# Altium schematic sheet Digitalizador_RPi (Copia en conflicto de Ivan Palacios 2020-06-25).SchDoc
size A1
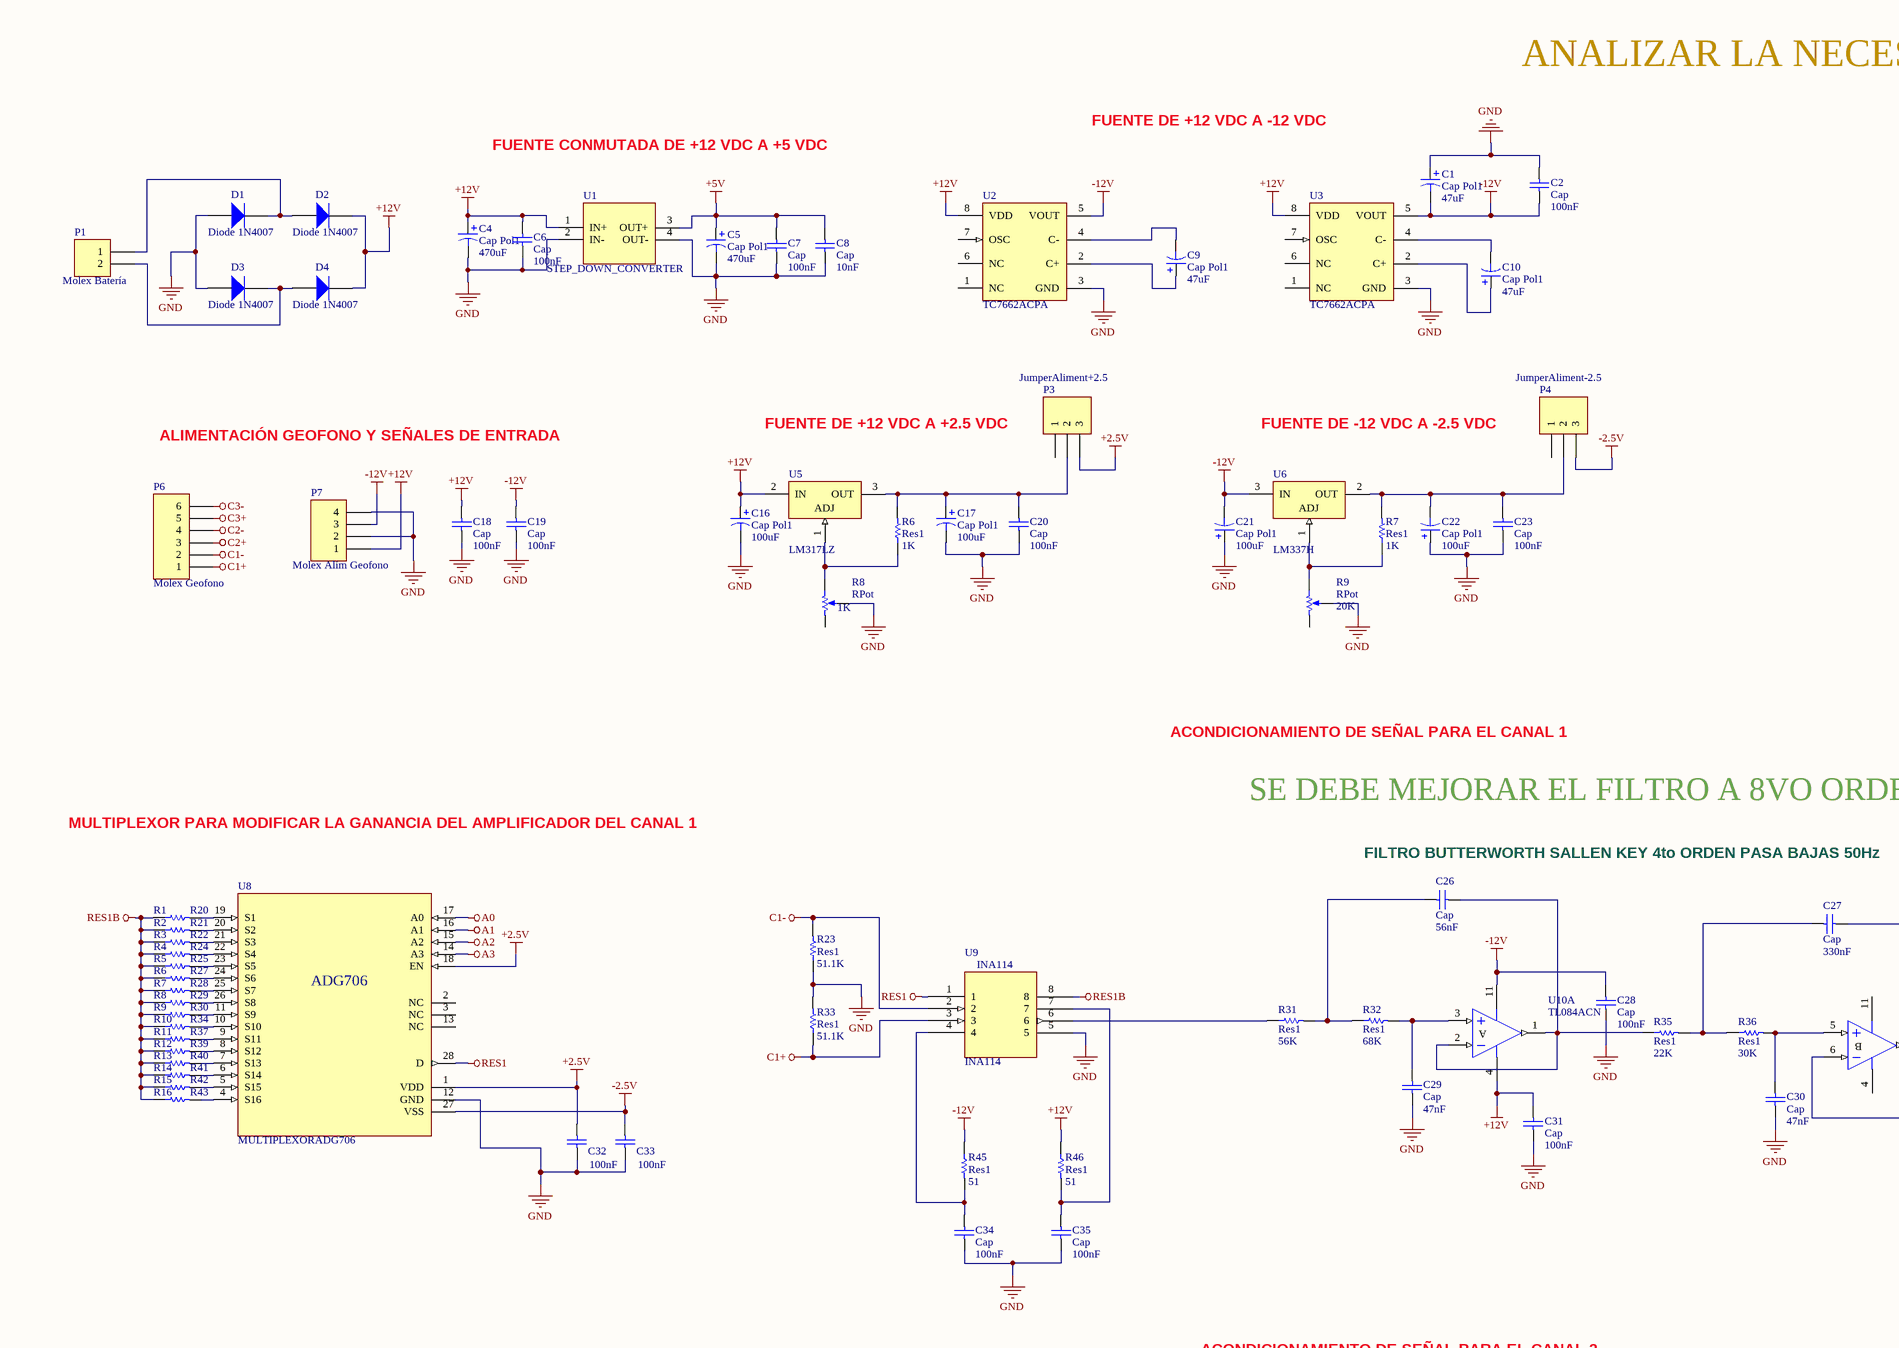
[diagram p0: Digitalizador_RPi (Copia en conflicto de Ivan Palacios 2020-06-25).SchDoc, top left]
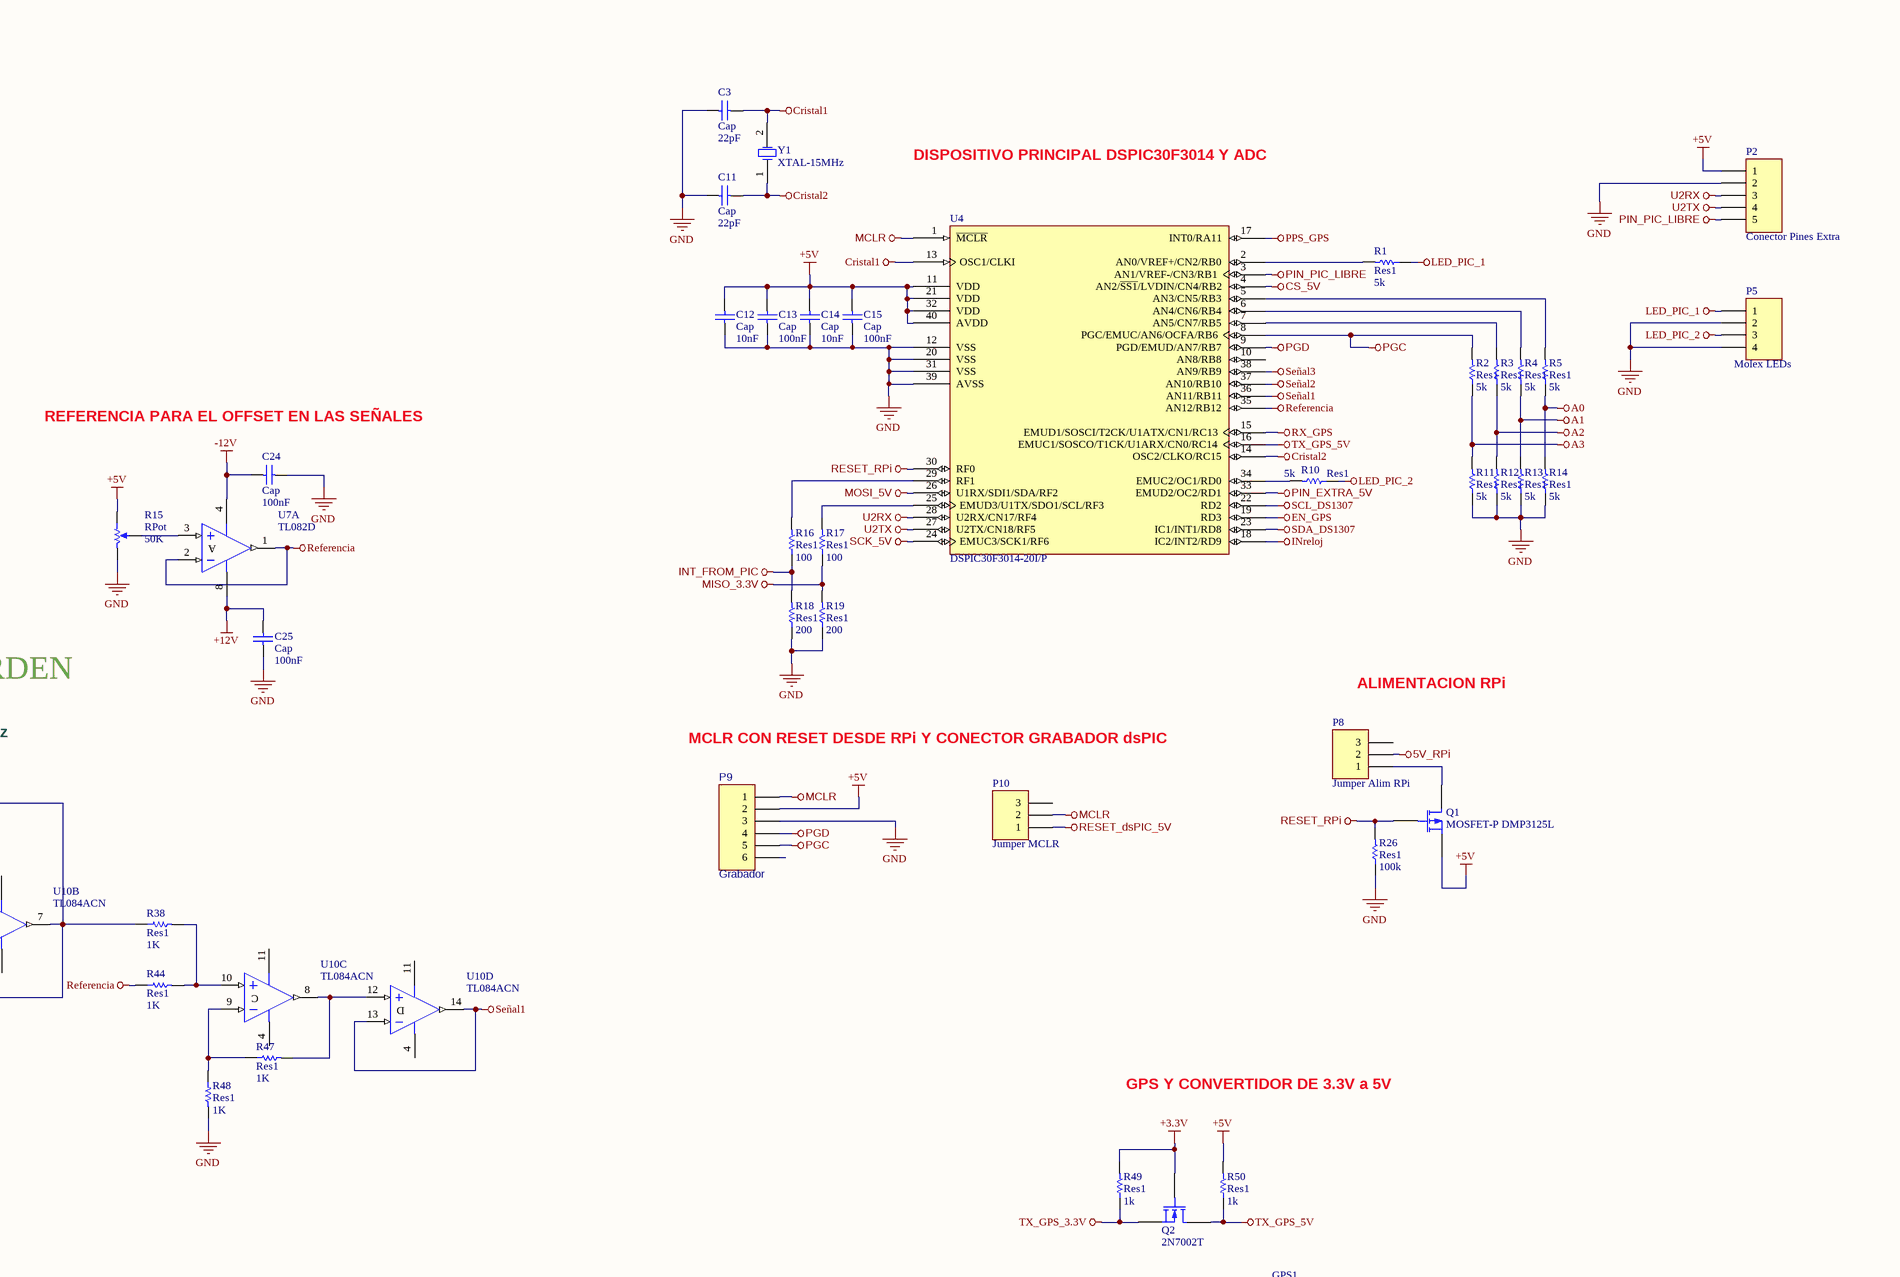
[diagram p1: Digitalizador_RPi (Copia en conflicto de Ivan Palacios 2020-06-25).SchDoc, top right]
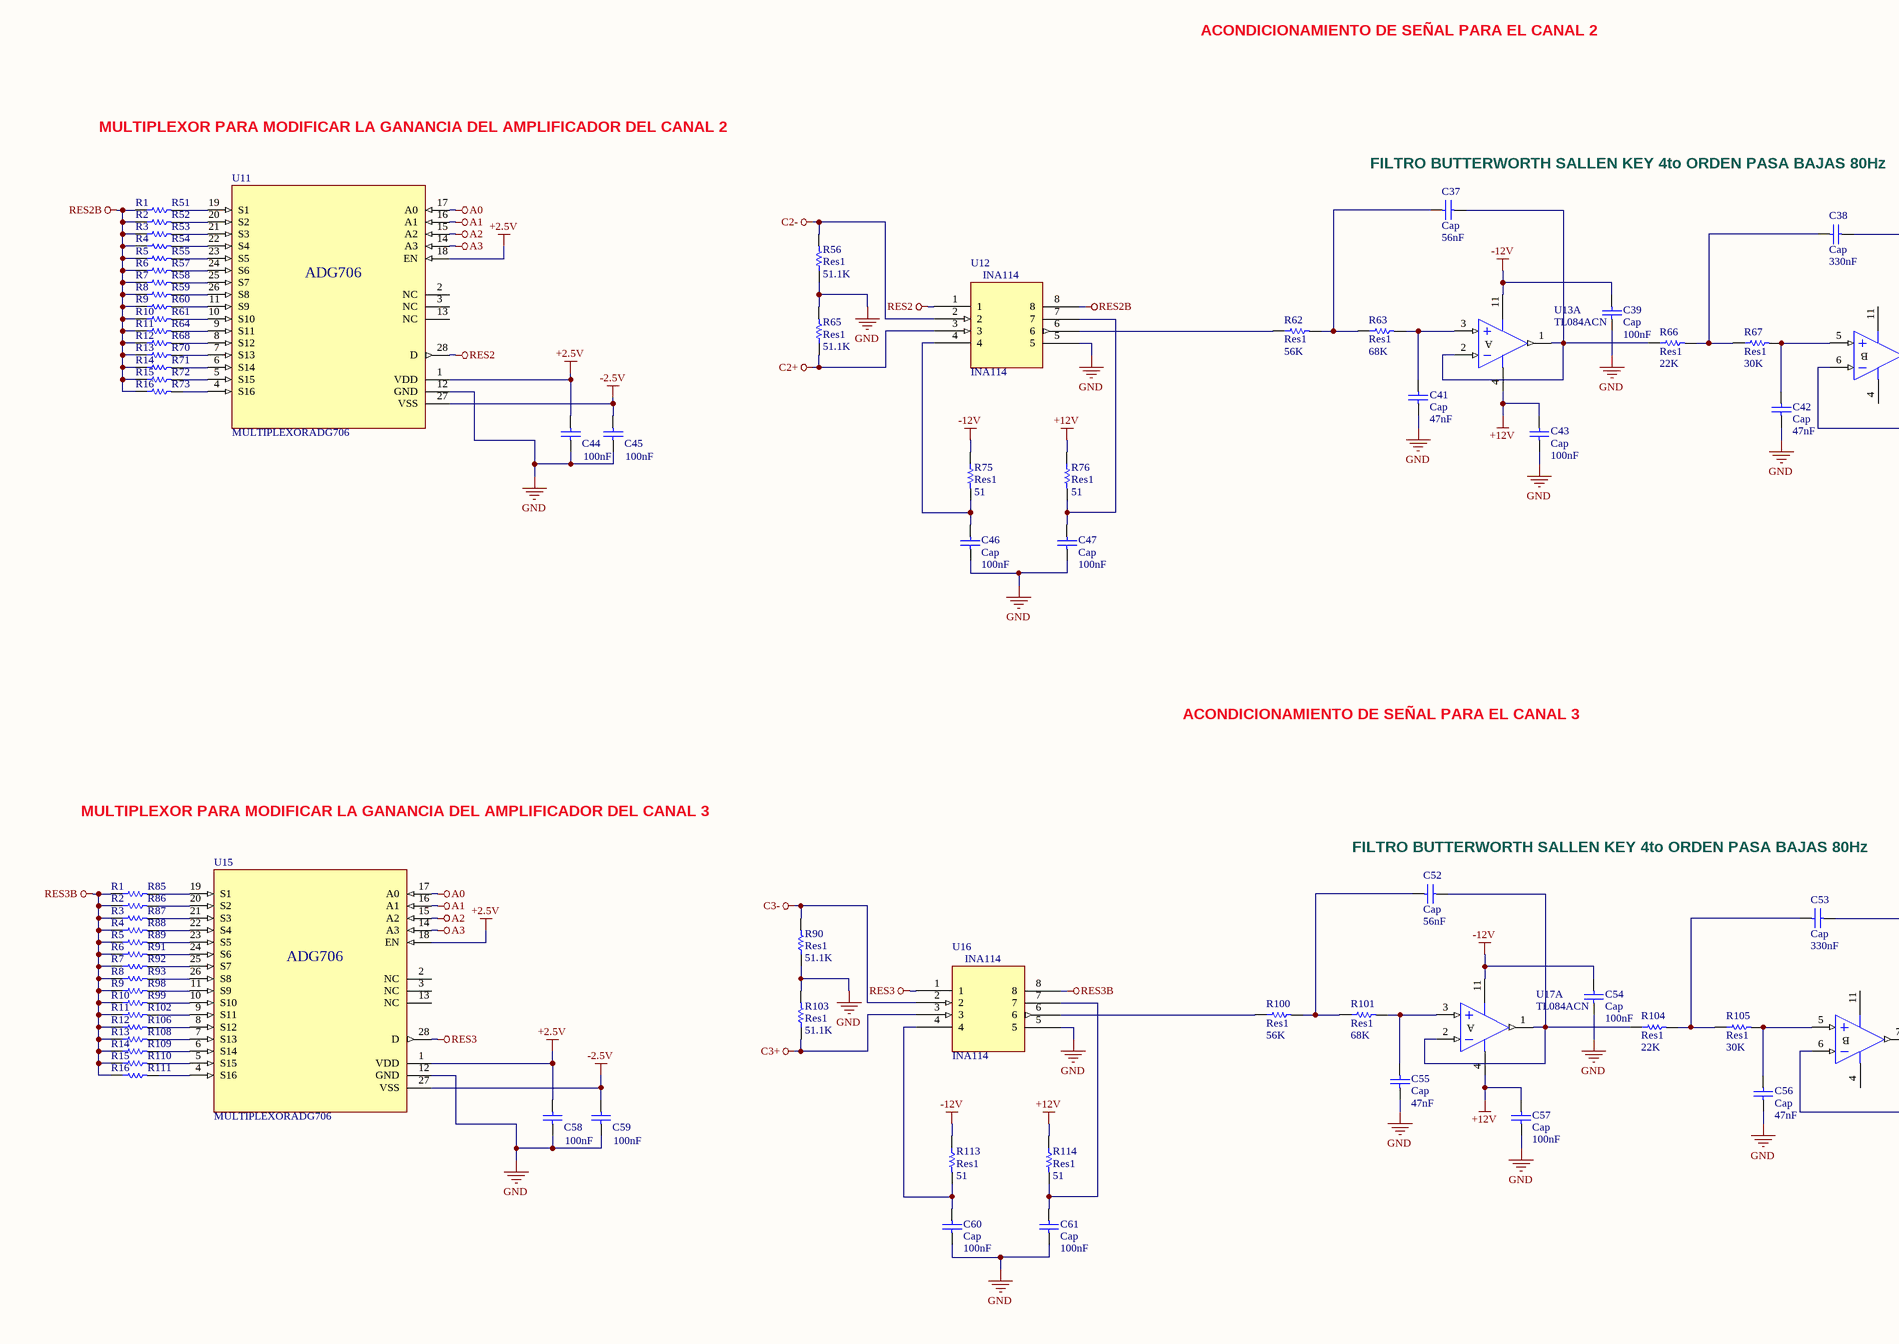
[diagram p2: Digitalizador_RPi (Copia en conflicto de Ivan Palacios 2020-06-25).SchDoc, bottom left]
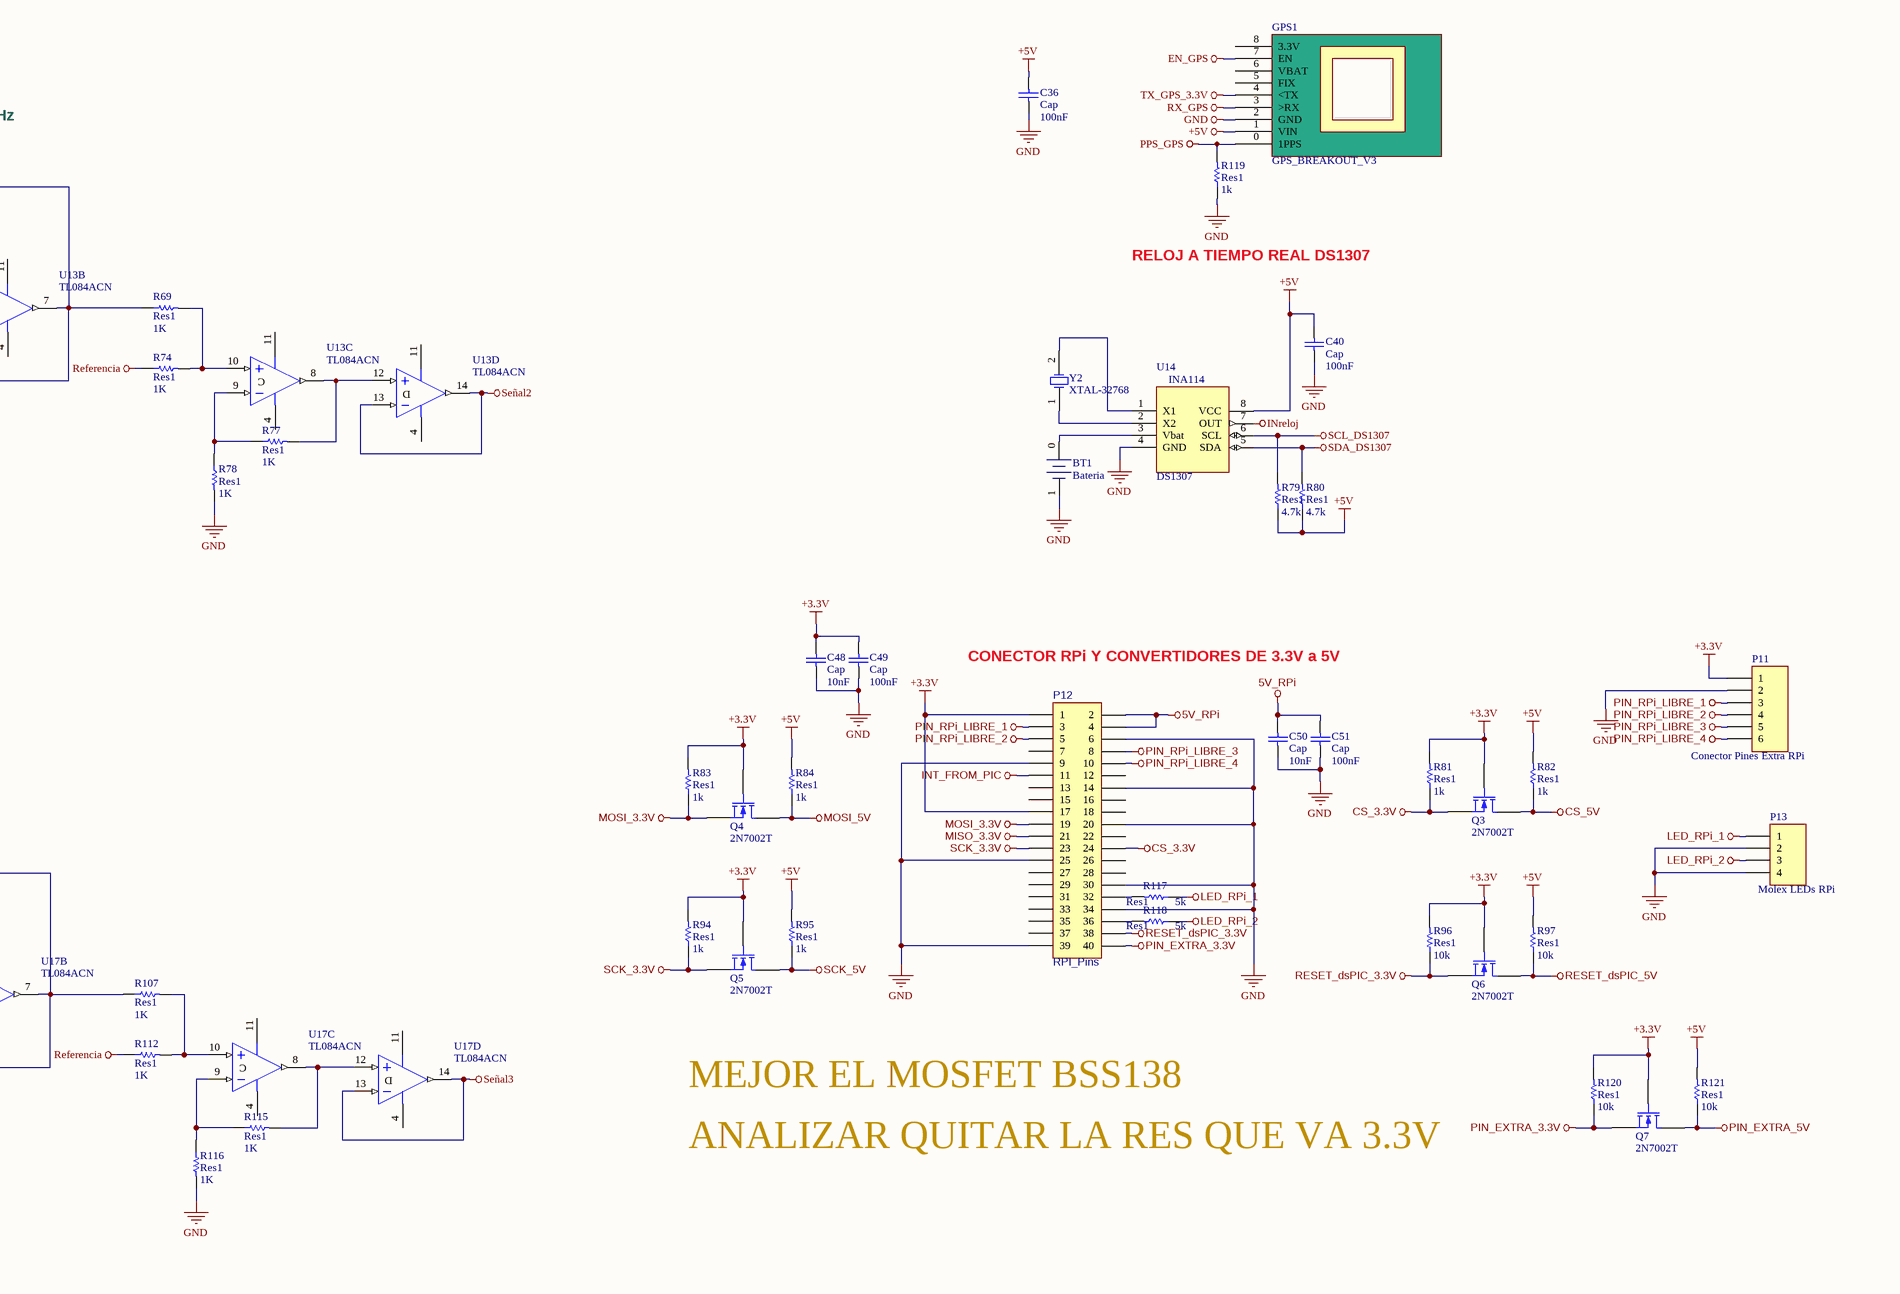
[diagram p3: Digitalizador_RPi (Copia en conflicto de Ivan Palacios 2020-06-25).SchDoc, bottom right]

## Parts
BT1  Bateria  [Bateria-DS1307]
C1  Cap Pol1  value 47uF  [CAP_5.5MM]
C2  Cap  value 100nF  [0603]
C3  Cap  value 22pF  [0603]
C4  Cap Pol1  value 470uF  [CAP_8.5mm]
C5  Cap Pol1  value 470uF  [CAP_8.5mm]
C6  Cap  value 100nF  [0603]
C7  Cap  value 100nF  [0603]
C8  Cap  value 10nF  [0603]
C9  Cap Pol1  value 47uF  [CAP_5.5MM]
C10  Cap Pol1  value 47uF  [CAP_5.5MM]
C11  Cap  value 22pF  [0603]
C12  Cap  value 10nF  [0603]
C13  Cap  value 100nF  [0603]
C14  Cap  value 10nF  [0603]
C15  Cap  value 100nF  [0603]
C16  Cap Pol1  value 100uF  [CAP_5.5MM]
C17  Cap Pol1  value 100uF  [CAP_5.5MM]
C18  Cap  value 100nF  [0603]
C19  Cap  value 100nF  [0603]
C20  Cap  value 100nF  [0603]
C21  Cap Pol1  value 100uF  [CAP_5.5MM]
C22  Cap Pol1  value 100uF  [CAP_5.5MM]
C23  Cap  value 100nF  [0603]
C24  Cap  value 100nF  [0603]
C25  Cap  value 100nF  [0603]
C26  Cap  value 56nF  [RAD0.2]
C27  Cap  value 330nF  [RAD0.2]
C28  Cap  value 100nF  [0603]
C29  Cap  value 47nF  [RAD0.2]
C30  Cap  value 47nF  [RAD0.2]
C31  Cap  value 100nF  [0603]
C32  100nF  [0603]
C33  100nF  [0603]
C34  Cap  value 100nF  [0603]
C35  Cap  value 100nF  [0603]
C36  Cap  value 100nF  [0603]
C37  Cap  value 56nF  [RAD0.2]
C38  Cap  value 330nF  [RAD0.2]
C39  Cap  value 100nF  [0603]
C40  Cap  value 100nF  [0603]
C41  Cap  value 47nF  [RAD0.2]
C42  Cap  value 47nF  [RAD0.2]
C43  Cap  value 100nF  [0603]
C44  100nF  [0603]
C45  100nF  [0603]
C46  Cap  value 100nF  [0603]
C47  Cap  value 100nF  [0603]
C48  Cap  value 10nF  [0603]
C49  Cap  value 100nF  [0603]
C50  Cap  value 10nF  [0603]
C51  Cap  value 100nF  [0603]
C52  Cap  value 56nF  [RAD0.2]
C53  Cap  value 330nF  [RAD0.2]
C54  Cap  value 100nF  [0603]
C55  Cap  value 47nF  [RAD0.2]
C56  Cap  value 47nF  [RAD0.2]
C57  Cap  value 100nF  [0603]
C58  100nF  [0603]
C59  100nF  [0603]
C60  Cap  value 100nF  [0603]
C61  Cap  value 100nF  [0603]
D1  Diode 1N4007  [DIODE-0.4A]
D2  Diode 1N4007  [DIODE-0.4A]
D3  Diode 1N4007  [DIODE-0.4A]
D4  Diode 1N4007  [DIODE-0.4A]
GPS1  GPS_BREAKOUT_V3  [GPS_BREAKOUT_V3]
P1  Molex Batería  [MOLEX-2]
P2  Conector Pines Extra  [HDR1X5]
P3  JumperAliment+2.5  [SIP-1X3-M]
P4  JumperAliment-2.5  [SIP-1X3-M]
P5  Molex LEDs  [MOLEX-4]
P6  Molex Geofono  [MOLEX-6]
P7  Molex Alim Geofono  [MOLEX-4]
P8  Jumper Alim RPi  [SIP-1X3-M]
P9  Grabador  [HDR1X6]
P10  Jumper MCLR  [SIP-1X3-M]
P11  Conector Pines Extra RPi  [HDR1X6]
P12  RPI_Pins  [SIP-2X20-M]
P13  Molex LEDs RPi  [MOLEX-4]
Q1  MOSFET-P DMP3125L  [SOT23-3L]
Q2  2N7002T  [SOT523]
Q3  2N7002T  [SOT523]
Q4  2N7002T  [SOT523]
Q5  2N7002T  [SOT523]
Q6  2N7002T  [SOT523]
Q7  2N7002T  [SOT523]
R1  Res1  value 5k  [0805]
R2  Res1  value 5k  [0805]
R3  Res1  value 5k  [0805]
R4  Res1  value 5k  [0805]
R5  Res1  value 5k  [0805]
R6  Res1  value 1K  [0805]
R7  Res1  value 1K  [0805]
R8  RPot  value 1K  [VR-5t]
R9  RPot  value 20K  [VR-5t]
R10  Res1  value 5k  [0805]
R11  Res1  value 5k  [0805]
R12  Res1  value 5k  [0805]
R13  Res1  value 5k  [0805]
R14  Res1  value 5k  [0805]
R15  RPot  value 50K  [VR-5t]
R16  Res1  value 100  [0805]
R17  Res1  value 100  [0805]
R18  Res1  value 200  [0805]
R19  Res1  value 200  [0805]
R20  value R1  [0805]
R21  value R2  [0805]
R22  value R3  [0805]
R23  Res1  value 51.1K  [0805]
R24  value R4  [0805]
R25  value R5  [0805]
R26  Res1  value 100k  [0805]
R27  value R6  [0805]
R28  value R7  [0805]
R29  value R8  [0805]
R30  value R9  [0805]
R31  Res1  value 56K  [0805]
R32  Res1  value 68K  [0805]
R33  Res1  value 51.1K  [0805]
R34  value R10  [0805]
R35  Res1  value 22K  [0805]
R36  Res1  value 30K  [0805]
R37  value R11  [0805]
R38  Res1  value 1K  [0805]
R39  value R12  [0805]
R40  value R13  [0805]
R41  value R14  [0805]
R42  value R15  [0805]
R43  value R16  [0805]
R44  Res1  value 1K  [0805]
R45  Res1  value 51  [0805]
R46  Res1  value 51  [0805]
R47  Res1  value 1K  [0805]
R48  Res1  value 1K  [0805]
R49  Res1  value 1k  [0805]
R50  Res1  value 1k  [0805]
R51  value R1  [0805]
R52  value R2  [0805]
R53  value R3  [0805]
R54  value R4  [0805]
R55  value R5  [0805]
R56  Res1  value 51.1K  [0805]
R57  value R6  [0805]
R58  value R7  [0805]
R59  value R8  [0805]
R60  value R9  [0805]
R61  value R10  [0805]
R62  Res1  value 56K  [0805]
R63  Res1  value 68K  [0805]
R64  value R11  [0805]
R65  Res1  value 51.1K  [0805]
R66  Res1  value 22K  [0805]
R67  Res1  value 30K  [0805]
R68  value R12  [0805]
R69  Res1  value 1K  [0805]
R70  value R13  [0805]
R71  value R14  [0805]
R72  value R15  [0805]
R73  value R16  [0805]
R74  Res1  value 1K  [0805]
R75  Res1  value 51  [0805]
R76  Res1  value 51  [0805]
R77  Res1  value 1K  [0805]
R78  Res1  value 1K  [0805]
R79  Res1  value 4.7k  [0805]
R80  Res1  value 4.7k  [0805]
R81  Res1  value 1k  [0805]
R82  Res1  value 1k  [0805]
R83  Res1  value 1k  [0805]
R84  Res1  value 1k  [0805]
R85  value R1  [0805]
R86  value R2  [0805]
R87  value R3  [0805]
R88  value R4  [0805]
R89  value R5  [0805]
R90  Res1  value 51.1K  [0805]
R91  value R6  [0805]
R92  value R7  [0805]
R93  value R8  [0805]
R94  Res1  value 1k  [0805]
R95  Res1  value 1k  [0805]
R96  Res1  value 10k  [0805]
R97  Res1  value 10k  [0805]
R98  value R9  [0805]
R99  value R10  [0805]
R100  Res1  value 56K  [0805]
R101  Res1  value 68K  [0805]
R102  value R11  [0805]
R103  Res1  value 51.1K  [0805]
R104  Res1  value 22K  [0805]
R105  Res1  value 30K  [0805]
R106  value R12  [0805]
R107  Res1  value 1K  [0805]
R108  value R13  [0805]
R109  value R14  [0805]
R110  value R15  [0805]
R111  value R16  [0805]
R112  Res1  value 1K  [0805]
R113  Res1  value 51  [0805]
R114  Res1  value 51  [0805]
R115  Res1  value 1K  [0805]
R116  Res1  value 1K  [0805]
R117  Res1  value 5k  [0805]
R118  Res1  value 5k  [0805]
R119  Res1  value 1k  [0805]
R120  Res1  value 10k  [0805]
R121  Res1  value 10k  [0805]
U1  STEP_DOWN_CONVERTER  [STEP_DOWN_CONVERTER]
U2  TC7662ACPA  [DIP-8]
U3  TC7662ACPA  [DIP-8]
U4  DSPIC30F3014-20I/P  [DIP-40]
U5  LM317LZ  [TO-92B_2]
U6  LM337H  [TO-220V]
U7  TL082D  [DIP-8]  (part A of 2)
U8  MULTIPLEXORADG706  [MULTIPLEXORADG706SMD]
U9  INA114  [DIP-8]
U10  TL084ACN  [SOIC-14]  (parts A,B,C,D of 4)
U11  MULTIPLEXORADG706  [MULTIPLEXORADG706SMD]
U12  INA114  [DIP-8]
U13  TL084ACN  [SOIC-14]  (parts A,B,C,D of 4)
U14  DS1307  [DIP-8]
U15  MULTIPLEXORADG706  [MULTIPLEXORADG706SMD]
U16  INA114  [DIP-8]
U17  TL084ACN  [SOIC-14]  (parts A,B,C,D of 4)
Y1  XTAL-15MHz  [CRISTAL10MHz]
Y2  XTAL-32768  [CRISTAL32768]

## Nets
5V_RPi: C50.2 C51.2 P8.2 P12.2 P12.4
+2.5V: C32.2 C44.2 C58.2 P3.3 U8.1(VDD) U8.18(EN) U11.1(VDD) U11.18(EN) U15.1(VDD) U15.18(EN)
+3.3V: C48.2 C49.2 P11.1 P12.1 P12.17 Q2.1(G) Q3.1(G) Q4.1(G) Q5.1(G) Q6.1(G) Q7.1(G) R49.2 R81.2 R83.2 R94.2 R96.2 R120.2
+5V: C5.1 C7.2 C8.2 C12.2 C13.2 C14.2 C15.2 C36.2 C40.2 GPS1.1(VIN) P2.1 P9.2 Q1.3(S) R15.1(TOP) R50.2 R79.1 R80.1 R82.2 R84.2 R95.2 R97.2 R121.2 U1.3(OUT+) U4.11(VDD) U4.21(VDD) U4.32(VDD) U4.40(AVDD) U14.8(VCC)
+12V: C4.1 C6.2 C16.1 C18.2 C25.2 C31.2 C43.2 C57.2 D2.2(K) D4.2(K) P7.1 R46.1 R76.1 R114.1 U1.1(IN+) U2.8(VDD) U3.8(VDD) U5.2(IN) U7.8(V+) U10.4(V+) U13.4(V+) U17.4(V+)
-2.5V: C33.2 C45.2 C59.2 P4.3 U8.27(VSS) U11.27(VSS) U15.27(VSS)
-12V: C1.2 C2.1 C19.2 C21.2 C24.2 C28.2 C39.2 C54.2 P7.3 R45.1 R75.1 R113.1 U2.5(VOUT) U3.5(VOUT) U6.3(IN) U7.4(V-) U10.11(V-) U13.11(V-) U17.11(V-)
A0: R5.1 R14.2 U8.17(A0) U11.17(A0) U15.17(A0)
A1: R4.1 R13.2 U8.16(A1) U11.16(A1) U15.16(A1)
A2: R3.1 R12.2 U8.15(A2) U11.15(A2) U15.15(A2)
A3: R2.1 R11.2 U8.14(A3) U11.14(A3) U15.14(A3)
C1+: P6.1 R33.1 U9.3
C1-: P6.2 R23.2 U9.2
C2+: P6.3 R65.1 U12.3
C2-: P6.4 R56.2 U12.2
C3+: P6.5 R103.1 U16.3
C3-: P6.6 R90.2 U16.2
Cristal1: C3.1 U4.13(OSC1/CLKI) Y1.2(OSC2)
Cristal2: C11.1 U4.14(OSC2/CLKO/RC15) Y1.1(OSC1)
CS_3.3V: P12.24 Q3.2(S) R81.1
CS_5V: Q3.3(D) R82.1 U4.4(AN2/~{SS1}/LVDIN/CN4/RB2)
EN_GPS: GPS1.7(EN) U4.19(RD3)
GND: BT1.1(-) C1.1 C2.2 C3.2 C4.2 C5.2 C6.1 C7.1 C8.1 C11.2 C12.1 C13.1 C14.1 C15.1 C16.2 C17.2 C18.1 C19.1 C20.1 C21.1 C22.1 C23.1 C24.1 C25.1 C28.1 C29.2 C30.2 C31.1 C32.1 C33.1 C34.1 C35.1 C36.1 C39.1 C40.1 C41.2 C42.2 C43.1 C44.1 C45.1 C46.1 C47.1 C48.1 C49.1 C50.1 C51.1 C54.1 C55.2 C56.2 C57.1 C58.1 C59.1 C60.1 C61.1 D1.1(A) D3.1(A) GPS1.2(GND) P2.2 P5.2 P5.4 P7.2 P7.4 P9.3 P11.2 P12.6 P12.9 P12.14 P12.20 P12.25 P12.30 P12.34 P12.39 P13.2 P13.4 R8.3(TAP) R9.3(TAP) R11.1 R12.1 R13.1 R14.1 R15.2(BOT) R18.1 R19.1 R23.1 R26.1 R33.2 R48.2 R56.1 R65.2 R78.2 R90.1 R103.2 R116.2 R119.1 U1.2(IN-) U1.4(OUT-) U2.3(GND) U3.3(GND) U4.12(VSS) U4.20(VSS) U4.31(VSS) U4.39(AVSS) U8.12(GND) U9.5 U11.12(GND) U12.5 U14.4(GND) U15.12(GND) U16.5
INreloj: U4.18(IC2/INT2/RD9) U14.7(OUT)
INT_FROM_PIC: P12.11 R16.1 R18.2
LED_PIC_1: P5.1 R1.1
LED_PIC_2: P5.3 R10.1
LED_RPi_1: P13.1 R117.1
LED_RPi_2: P13.3 R118.1
MCLR: P9.1 P10.2 U4.1(~{MCLR})
MISO_3.3V: P12.21 R17.1 R19.2
MOSI_3.3V: P12.19 Q4.2(S) R83.1
MOSI_5V: Q4.3(D) R84.1 U4.26(U1RX/SDI1/SDA/RF2)
PGC: P9.5 R2.2 U4.8(PGC/EMUC/AN6/OCFA/RB6)
PGD: P9.4 U4.9(PGD/EMUD/AN7/RB7)
PIN_EXTRA_3.3V: P12.40 Q7.2(S) R120.1
PIN_EXTRA_5V: Q7.3(D) R121.1 U4.33(EMUD2/OC2/RD1)
PIN_PIC_LIBRE: P2.5 U4.3(AN1/VREF-/CN3/RB1)
PIN_RPi_LIBRE_1: P11.3 P12.3
PIN_RPi_LIBRE_2: P11.4 P12.5
PIN_RPi_LIBRE_3: P11.5 P12.8
PIN_RPi_LIBRE_4: P11.6 P12.10
PPS_GPS: GPS1.0(1PPS) R119.2 U4.17(INT0/RA11)
Referencia: R44.1 R74.1 R112.1 U4.35(AN12/RB12) U7.1(OUT) U7.2(IN-)
RES1: U8.28(D) U9.1
RES1B: R20.1 R21.1 R22.1 R24.1 R25.1 R27.1 R28.1 R29.1 R30.1 R34.1 R37.1 R39.1 R40.1 R41.1 R42.1 R43.1 U9.8
RES2: U11.28(D) U12.1
RES2B: R51.1 R52.1 R53.1 R54.1 R55.1 R57.1 R58.1 R59.1 R60.1 R61.1 R64.1 R68.1 R70.1 R71.1 R72.1 R73.1 U12.8
RES3: U15.28(D) U16.1
RES3B: R85.1 R86.1 R87.1 R88.1 R89.1 R91.1 R92.1 R93.1 R98.1 R99.1 R102.1 R106.1 R108.1 R109.1 R110.1 R111.1 U16.8
RESET_dsPIC_3.3V: P12.38 Q6.2(S) R96.1
RESET_dsPIC_5V: P10.1 Q6.3(D) R97.1
RESET_RPi: Q1.2(G) R26.2 U4.30(RF0)
RX_GPS: GPS1.3(>RX) U4.15(EMUD1/SOSCI/T2CK/U1ATX/CN1/RC13)
SCK_3.3V: P12.23 Q5.2(S) R94.1
SCK_5V: Q5.3(D) R95.1 U4.24(EMUC3/SCK1/RF6)
SCL_DS1307: R79.2 U4.22(RD2) U14.6(SCL)
SDA_DS1307: R80.2 U4.23(IC1/INT1/RD8) U14.5(SDA)
Señal1: U4.36(AN11/RB11) U10.13(IN-) U10.14(OUT)
Señal2: U4.37(AN10/RB10) U13.13(IN-) U13.14(OUT)
Señal3: U4.38(AN9/RB9) U17.13(IN-) U17.14(OUT)
TX_GPS_3.3V: GPS1.4(<TX) Q2.2(S) R49.1
TX_GPS_5V: Q2.3(D) R50.1 U4.16(EMUC1/SOSCO/T1CK/U1ARX/CN0/RC14)
U2RX: P2.3 U4.28(U2RX/CN17/RF4)
U2TX: P2.4 U4.27(U2TX/CN18/RF5)
NetBT1_0: BT1.0(+) U14.3(Vbat)
NetC9_1: C9.1 U2.2(C+)
NetC9_2: C9.2 U2.4(C-)
NetC10_1: C10.1 U3.2(C+)
NetC10_2: C10.2 U3.4(C-)
NetC17_1: C17.1 C20.2 P3.2 R6.2 U5.3(OUT)
NetC22_2: C22.2 C23.2 P4.2 R7.2 U6.2(OUT)
NetC26_1: C26.1 R35.1 U10.1(OUT) U10.2(IN-)
NetC26_2: C26.2 R31.2 R32.1
NetC27_1: C27.1 R38.1 U10.6(IN-) U10.7(OUT)
NetC27_2: C27.2 R35.2 R36.1
NetC29_1: C29.1 R32.2 U10.3(IN+)
NetC30_1: C30.1 R36.2 U10.5(IN+)
NetC34_2: C34.2 R45.2 U9.4
NetC35_2: C35.2 R46.2 U9.7
NetC37_1: C37.1 R66.1 U13.1(OUT) U13.2(IN-)
NetC37_2: C37.2 R62.2 R63.1
NetC38_1: C38.1 R69.1 U13.6(IN-) U13.7(OUT)
NetC38_2: C38.2 R66.2 R67.1
NetC41_1: C41.1 R63.2 U13.3(IN+)
NetC42_1: C42.1 R67.2 U13.5(IN+)
NetC46_2: C46.2 R75.2 U12.4
NetC47_2: C47.2 R76.2 U12.7
NetC52_1: C52.1 R104.1 U17.1(OUT) U17.2(IN-)
NetC52_2: C52.2 R100.2 R101.1
NetC53_1: C53.1 R107.1 U17.6(IN-) U17.7(OUT)
NetC53_2: C53.2 R104.2 R105.1
NetC55_1: C55.1 R101.2 U17.3(IN+)
NetC56_1: C56.1 R105.2 U17.5(IN+)
NetC60_2: C60.2 R113.2 U16.4
NetC61_2: C61.2 R114.2 U16.7
NetD1_2: D1.2(K) D2.1(A) P1.1
NetD3_2: D3.2(K) D4.1(A) P1.2
NetP8_1: P8.1 Q1.1(D)
NetP12_32: P12.32 R117.2
NetP12_36: P12.36 R118.2
NetR1_2: R1.2 U4.2(AN0/VREF+/CN2/RB0)
NetR3_2: R3.2 U4.7(AN5/CN7/RB5)
NetR4_2: R4.2 U4.6(AN4/CN6/RB4)
NetR5_2: R5.2 U4.5(AN3/CN5/RB3)
NetR6_1: R6.1 R8.1(TOP) U5.1(ADJ)
NetR7_1: R7.1 R9.1(TOP) U6.1(ADJ)
NetR10_2: R10.2 U4.34(EMUC2/OC1/RD0)
NetR15_3: R15.3(TAP) U7.3(IN+)
NetR16_2: R16.2 U4.29(RF1)
NetR17_2: R17.2 U4.25(EMUD3/U1TX/SDO1/SCL/RF3)
NetR20_2: R20.2 U8.19(S1)
NetR21_2: R21.2 U8.20(S2)
NetR22_2: R22.2 U8.21(S3)
NetR24_2: R24.2 U8.22(S4)
NetR25_2: R25.2 U8.23(S5)
NetR27_2: R27.2 U8.24(S6)
NetR28_2: R28.2 U8.25(S7)
NetR29_2: R29.2 U8.26(S8)
NetR30_2: R30.2 U8.11(S9)
NetR31_1: R31.1 U9.6
NetR34_2: R34.2 U8.10(S10)
NetR37_2: R37.2 U8.9(S11)
NetR38_2: R38.2 R44.2 U10.10(IN+)
NetR39_2: R39.2 U8.8(S12)
NetR40_2: R40.2 U8.7(S13)
NetR41_2: R41.2 U8.6(S14)
NetR42_2: R42.2 U8.5(S15)
NetR43_2: R43.2 U8.4(S16)
NetR47_1: R47.1 R48.1 U10.9(IN-)
NetR47_2: R47.2 U10.8(OUT) U10.12(IN+)
NetR51_2: R51.2 U11.19(S1)
NetR52_2: R52.2 U11.20(S2)
NetR53_2: R53.2 U11.21(S3)
NetR54_2: R54.2 U11.22(S4)
NetR55_2: R55.2 U11.23(S5)
NetR57_2: R57.2 U11.24(S6)
NetR58_2: R58.2 U11.25(S7)
NetR59_2: R59.2 U11.26(S8)
NetR60_2: R60.2 U11.11(S9)
NetR61_2: R61.2 U11.10(S10)
NetR62_1: R62.1 U12.6
NetR64_2: R64.2 U11.9(S11)
NetR68_2: R68.2 U11.8(S12)
NetR69_2: R69.2 R74.2 U13.10(IN+)
NetR70_2: R70.2 U11.7(S13)
NetR71_2: R71.2 U11.6(S14)
NetR72_2: R72.2 U11.5(S15)
NetR73_2: R73.2 U11.4(S16)
NetR77_1: R77.1 R78.1 U13.9(IN-)
NetR77_2: R77.2 U13.8(OUT) U13.12(IN+)
NetR85_2: R85.2 U15.19(S1)
NetR86_2: R86.2 U15.20(S2)
NetR87_2: R87.2 U15.21(S3)
NetR88_2: R88.2 U15.22(S4)
NetR89_2: R89.2 U15.23(S5)
NetR91_2: R91.2 U15.24(S6)
NetR92_2: R92.2 U15.25(S7)
NetR93_2: R93.2 U15.26(S8)
NetR98_2: R98.2 U15.11(S9)
NetR99_2: R99.2 U15.10(S10)
NetR100_1: R100.1 U16.6
NetR102_2: R102.2 U15.9(S11)
NetR106_2: R106.2 U15.8(S12)
NetR107_2: R107.2 R112.2 U17.10(IN+)
NetR108_2: R108.2 U15.7(S13)
NetR109_2: R109.2 U15.6(S14)
NetR110_2: R110.2 U15.5(S15)
NetR111_2: R111.2 U15.4(S16)
NetR115_1: R115.1 R116.1 U17.9(IN-)
NetR115_2: R115.2 U17.8(OUT) U17.12(IN+)
NetU14_1: U14.1(X1) Y2.2(OSC2)
NetU14_2: U14.2(X2) Y2.1(OSC1)

Not connected (* = marked no-connect by the designer): GPS1 5(FIX) 6(VBAT) 8(3.3V); P3 1; P4 1; P8 3; P9 6; P10 3; P12 7 12 13 15 16 18 22 26 27 28 29 31 33 35 37; R8 2(BOT); R9 2(BOT); U2 1(NC) 6(NC) 7(OSC); U3 1(NC) 6(NC) 7(OSC); U4 10(AN8/RB8); U8 2(NC) 3(NC) 13(NC); U11 2(NC) 3(NC) 13(NC); U15 2(NC) 3(NC) 13(NC)

## Notes on the sheet
- ANALIZAR LA NECESIDAD DE LA FUENTE DE 3.3
- FUENTE CONMUTADA DE +12 VDC A +5 VDC
- FUENTE DE +12 VDC A -12 VDC
- DISPOSITIVO PRINCIPAL DSPIC30F3014 Y ADC
- ALIMENTACIÓN GEOFONO Y SEÑALES DE ENTRADA
- FUENTE DE +12 VDC A +2.5 VDC
- FUENTE DE -12 VDC A -2.5 VDC
- REFERENCIA PARA EL OFFSET EN LAS SEÑALES
- ACONDICIONAMIENTO DE SEÑAL PARA EL CANAL 1
- MULTIPLEXOR PARA MODIFICAR LA GANANCIA DEL AMPLIFICADOR DEL CANAL 1
- SE DEBE MEJORAR EL FILTRO A 8VO ORDEN
- ALIMENTACION RPi
- (near C26) FILTRO BUTTERWORTH SALLEN KEY 4to ORDEN PASA BAJAS 50Hz
- MCLR CON RESET DESDE RPi Y CONECTOR GRABADOR dsPIC
- GPS Y CONVERTIDOR DE 3.3V a 5V
- ACONDICIONAMIENTO DE SEÑAL PARA EL CANAL 2
- MULTIPLEXOR PARA MODIFICAR LA GANANCIA DEL AMPLIFICADOR DEL CANAL 2
- (near C37) FILTRO BUTTERWORTH SALLEN KEY 4to ORDEN PASA BAJAS 80Hz
- RELOJ A TIEMPO REAL DS1307
- ACONDICIONAMIENTO DE SEÑAL PARA EL CANAL 3
- CONECTOR RPi Y CONVERTIDORES DE 3.3V a 5V
- MULTIPLEXOR PARA MODIFICAR LA GANANCIA DEL AMPLIFICADOR DEL CANAL 3
- (near C52) FILTRO BUTTERWORTH SALLEN KEY 4to ORDEN PASA BAJAS 80Hz
- MEJOR EL MOSFET BSS138
- ANALIZAR QUITAR LA RES QUE VA 3.3V
- (in symbol DS1307) INA114
- (in symbol MULTIPLEXORADG706) ADG706
- (in symbol TL082D, part A) A
- (in symbol TL084ACN, part A) A
- (in symbol TL084ACN, part B) B
- (in symbol TL084ACN, part C) C
- (in symbol TL084ACN, part D) D

## Library data of the parts
BT1 = BateriaDS1307
C1 C4 C5 C9 C10 C16 C17 C21 C22 = Cap Pol1: Polarized Capacitor (Radial); Published: 8-Jun-2000; LatestRevisionDate: 17-Jul-2002; LatestRevisionNote: Re-released for DXP Platform.; PackageReference: RB7.6-15; Publisher: Altium Limited; PackageDescription: Polarized Capacitor (Radial); 2 Leads
C2 C3 C6-C8 C11-C15 C18-C20 C23-C31 C34-C43 C46-C57 C60 C61 = Cap: Capacitor; Published: 8-Jun-2000; LatestRevisionDate: 17-Jul-2002; LatestRevisionNote: Re-released for DXP Platform.; PackageReference: RAD-0.3; Publisher: Altium Limited; PackageDescription: Radial Cap, Thru-Hole; 2 Leads; 0.3 in Pin Spacing
C32 C33 C44 C45 C58 C59 = Capacitor ceramico
D1-D4 = Diode 1N4007: 1 Amp General Purpose Rectifier; Published: 8-Jun-2000; LatestRevisionDate: 17-Jul-2002; LatestRevisionNote: Re-released for DXP Platform.; DatasheetVersion: 1998; PackageVersion: Aug-1999; PackageReference: DO-41; Publisher: Altium Limited; PackageDescription: Diode, Axial; Body 5.2 x 2.7 mm (LxDia. max), Lead Dia. 0.86 mm (max); Code_JEDEC: DO-204-AL; ComponentLink1Description: Manufacturer Link; ComponentLink1URL: http://www.fairchildsemi.com/; ComponentLink2Description: Datasheet; ComponentLink2URL: http://www.fairchildsemi.com/ds/1N%2F1N4001.pdf
P1 = Header 2: Header, 2-Pin; LatestRevisionDate: 17-Jul-2002; LatestRevisionNote: Re-released for DXP Platform.; Publisher: Altium Limited
P2 = Header 5: Header, 5-Pin; LatestRevisionDate: 17-Jul-2002; LatestRevisionNote: Re-released for DXP Platform.; Publisher: Altium Limited
P3 P4 P8 P10 = Header 3: Header, 3-Pin; LatestRevisionDate: 17-Jul-2002; LatestRevisionNote: Re-released for DXP Platform.; Publisher: Altium Limited
P5 P7 P13 = Header 4: Header, 4-Pin; LatestRevisionDate: 17-Jul-2002; LatestRevisionNote: Re-released for DXP Platform.; Publisher: Altium Limited
P6 P9 P11 = Header 6: Header, 6-Pin; LatestRevisionDate: 17-Jul-2002; LatestRevisionNote: Re-released for DXP Platform.; Publisher: Altium Limited
P12 = Header 20X2: Header, 20-Pin, Dual row; LatestRevisionDate: 17-Jul-2002; LatestRevisionNote: Re-released for DXP Platform.; Publisher: Altium Limited
Q1 = MOSFET-P: P-Channel MOSFET; Published: 8-Jun-2000; LatestRevisionDate: 17-Jul-2002; LatestRevisionNote: Re-released for DXP Platform.; PackageVersion: 1995/1996; PackageReference: E3; Publisher: Altium Limited; PackageDescription: TO, Flat Index; 3 In-Line, Axial Leads; Body Dia. 4.6mm; Lead Dia. 0.5 mm (max)
Q2-Q7 = 2N7002T-7-F
R1-R7 R10-R14 R16-R121 = Res1: Resistor; Published: 8-Jun-2000; LatestRevisionDate: 17-Jul-2002; LatestRevisionNote: Re-released for DXP Platform.; PackageReference: AXIAL-0.3; Publisher: Altium Limited; PackageDescription: Axial Device, Thru-Hole; 2 Leads; 0.3 in Pin Spacing
R8 R9 R15 = RPot: Potentiometer; Sim Note: Enter the Resistance value and the set point into parameter fields.; Set Position: 0.5; Published: 8-Jun-2000; LatestRevisionDate: 17-Jul-2002; LatestRevisionNote: Re-released for DXP Platform.; PackageReference: VR5; Publisher: Altium Limited; PackageDescription: Variable Resistor, Thru-Hole; 3 Leads
U2 U3 = TC7662ACPA: Super Charge Pump DC-to-DC Voltage Converter, 12kHz, 8-Pin PDIP, Commercial Temperature; Published: 29-Jan-2009; DatasheetVersion: revB, Nov-2002; PackageVersion: revBB, Aug-2009; PackageReference: PDIP300-PA8; Publisher: Altium Limited; PackageDescription: 8-Lead Plastic Dual In-Line (PA) - 300 mil Body [PDIP]; Supplier 1: Digi-Key; Supplier Part Number 1: TC7662ACPA-ND; Supplier 2: Farnell; Supplier Part Number 2: 1196817; Code_JEDEC: MS-001-BA; ComponentLink1Description: Datasheet; ComponentLink1URL: http://ww1.microchip.com/downloads/en/DeviceDoc/21468b.pdf; ComponentLink2Description: Packaging Specification; ComponentLink2URL: http://www.microchip.com/stellent/groups/techpub_sg/documents/packagingspec/en012702.pdf; ComponentLink3Description: Microchip.com Home; ComponentLink3URL: http://www.microchip.com/
U4 = DSPIC30F3014-20I/P: High-Performance 16-bit Digital Signal Controller, 24 KB Flash, 2 KB SRAM, 1 KB EEPROM, 40-Pin PDIP, Industrial Temperature; Published: 29-Jan-2009; DatasheetVersion: revF, Apr-2008; PackageVersion: revBB, Aug-2009; PackageReference: PDIP600-P40; Publisher: Altium Limited; PackageDescription: 40-Lead Plastic Dual In-Line (P) - 600 mil Body [PDIP]; Supplier 1: Digi-Key; Supplier Part Number 1: DSPIC30F3014-20IP-ND; Supplier 2: Farnell; Supplier Part Number 2: 1621779; ComponentLink1Description: Datasheet; ComponentLink1URL: http://ww1.microchip.com/downloads/en/DeviceDoc/70138F.pdf; ComponentLink2Description: Packaging Specification; ComponentLink2URL: http://www.microchip.com/stellent/groups/techpub_sg/documents/packagingspec/en012702.pdf; ComponentLink3Description: Microchip.com Home; ComponentLink3URL: http://www.microchip.com/
U5 = LM317LZ: Low-Current 1.2V to 37V Voltage Regulator; Published: 24-Aug-2001; LatestRevisionDate: 17-Jul-2002; LatestRevisionNote: Re-released for DXP Platform.; DatasheetVersion: Apr-1994; PackageReference: TO92-132; Publisher: Altium Limited; PackageDescription: TO, Flat Index; 3 In-Line, Axial Leads; Body Dia. 4.8mm; Leads 0.51 x 0.51 mm (max); ComponentLink1Description: Manufacturer Link; ComponentLink1URL: http://www.st.com/; ComponentLink2Description: Datasheet; ComponentLink2URL: http://www.st.com/stonline/products/literature/ds/2168/lm217l.pdf
U6 = LM337H: Three-Terminal Adjustable Negative Voltage Regulator; Published: 24-Aug-2001; LatestRevisionDate: 17-Jul-2002; LatestRevisionNote: Re-released for DXP Platform.; DatasheetVersion: Mar-1993; PackageReference: TO-39; Publisher: Altium Limited; PackageDescription: Can; 3 Leads; Pin Circle Dia. 5.08 mm; Lead Dia. 0.49 mm (max); ComponentLink1Description: Manufacturer Link; ComponentLink1URL: http://www.st.com/; ComponentLink2Description: Datasheet; ComponentLink2URL: http://www.st.com/stonline/products/literature/ds/2167/lm137.pdf
U7 = TL082D: JFET-Input Operational Amplifier; Published: 16-Jan-2001; LatestRevisionDate: 13-Apr-2006; LatestRevisionNote: IPC-7351 Footprint Added.; DatasheetVersion: Feb-1999; PackageVersion: Jan-1998; PackageReference: D008; Publisher: Altium Limited; PackageDescription: 8-Pin Small Outline Integrated Circuit 1.27 mm Pitch; Code_IPC: SOIC127P600-8; ComponentLink1Description: Manufacturer Link; ComponentLink1URL: http://www.ti.com/; ComponentLink2Description: Datasheet; ComponentLink2URL: http://www-s.ti.com/sc/ds/tl082.pdf
U10 U13 U17 = TL084ACN: General-Purpose J-FET Quad Operational Amplifier; Published: 24-Aug-2001; LatestRevisionDate: 06-Jun-2005; LatestRevisionNote: Stylized 3D Model Added.; DatasheetVersion: Jan-1999; PackageVersion: Jan-1997; PackageReference: DIP14; Publisher: Altium Limited; PackageDescription: DIP; 14 Leads; Row Spacing 7.62 mm; Pitch 2.54 mm; ComponentLink1Description: Manufacturer Link; ComponentLink1URL: http://www.st.com/; ComponentLink2Description: Datasheet; ComponentLink2URL: http://www.st.com/stonline/products/literature/ds/2301/tl084.pdf
Y1 Y2 = XTAL: Crystal Oscillator; Published: 8-Jun-2000; LatestRevisionDate: 17-Jul-2002; LatestRevisionNote: Re-released for DXP Platform.; PackageReference: R38; Publisher: Altium Limited; PackageDescription: Crystal, Thru-Hole; 2 Leads; Body 3.1 x 8.2 mm (Dia.xH)